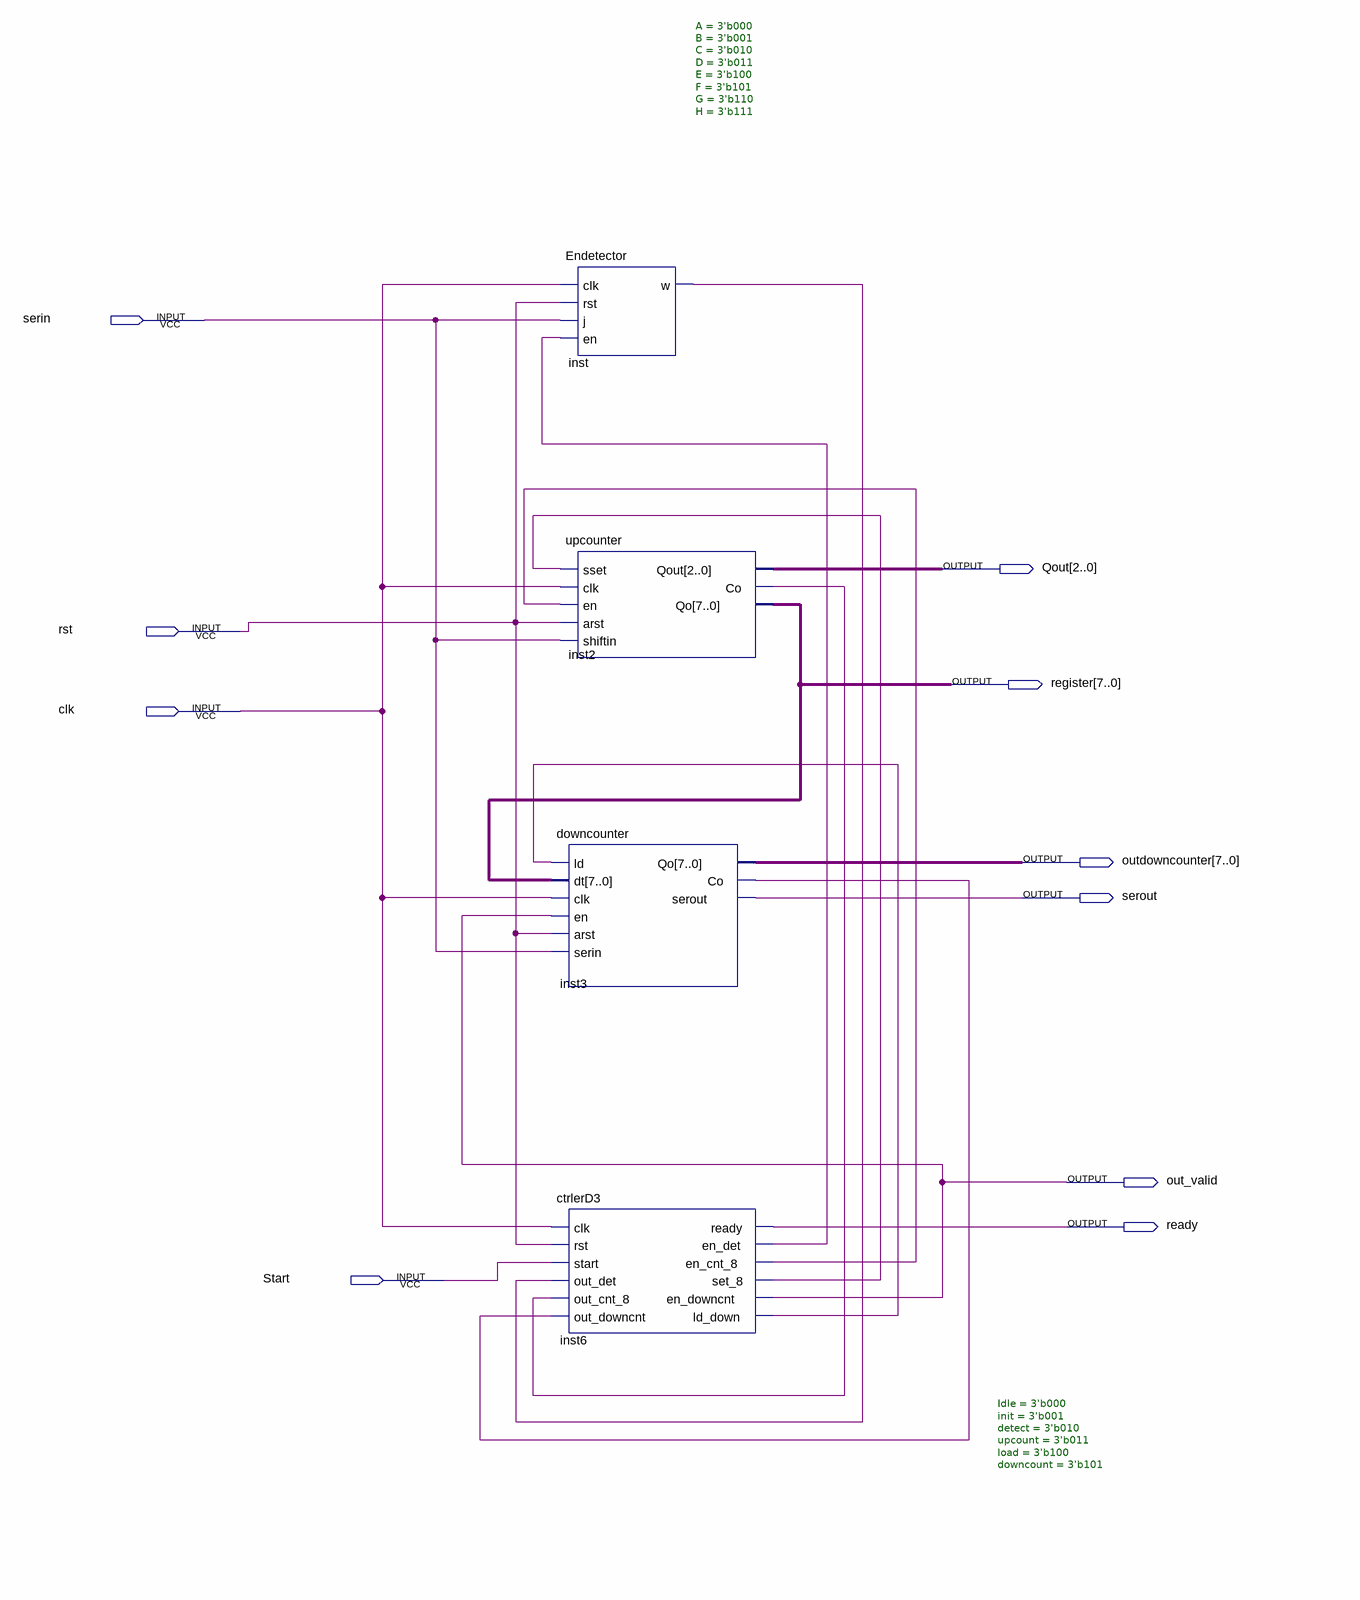
[diagram p0: schematic sheet]
// Quartus schematic Finalfile.bdf as structural Verilog: 4 symbols, 10 pins
module Finalfile (
  input  serin,
  input  rst,
  input  clk,
  input  Start,
  output [2:0] Qout,
  output [7:0] register,
  output [7:0] outdowncounter,
  output serout,
  output out_valid,
  output ready
);

  wire inst2_co, inst3_co, inst6_en_cnt_8, inst6_en_det, inst6_ld_down, inst6_set_8, inst_w;

  Endetector #(.A(3'b000), .B(3'b001), .C(3'b010), .D(3'b011), .E(3'b100), .F(3'b101), .G(3'b110), .H(3'b111)) inst (
    .clk(clk), .rst(rst), .j(serin), .en(inst6_en_det), .w(inst_w));
  upcounter inst2 (
    .sset(inst6_set_8), .clk(clk), .en(inst6_en_cnt_8), .arst(rst), .shiftin(serin), .Qout(Qout),
    .Co(inst2_co), .Qo(register));
  downcounter inst3 (
    .ld(inst6_ld_down), .dt(register), .clk(clk), .en(out_valid), .arst(rst), .serin(serin),
    .Qo(outdowncounter), .Co(inst3_co), .serout(serout));
  ctrlerD3 #(.Idle(3'b000), .init(3'b001), .detect(3'b010), .upcount(3'b011), .load(3'b100), .downcount(3'b101)) inst6 (
    .clk(clk), .rst(rst), .start(Start), .out_det(inst_w), .out_cnt_8(inst2_co), .out_downcnt(inst3_co),
    .ready(ready), .en_det(inst6_en_det), .en_cnt_8(inst6_en_cnt_8), .set_8(inst6_set_8),
    .en_downcnt(out_valid), .ld_down(inst6_ld_down));
endmodule
